# Altium project WiWi_SDR.PrjPcb (part 3 of 5)

## Sheet 11-Power.SchDoc
size B; SheetNumber: 11; SheetTotal: 19; SPICEModelCacheAVYIXNQT: <root> / <DocumentId>AVYIXNQT</DocumentId> / <CacheFrame Number="0"> / <Model Name="emk105bj105_v-f" Kind="CKT"> / <Text>* EMK105BJ105_V-F     SPICE MODEL  ( General Type ) / *-------------------------------------------------------------------------------------------------------- / * Model Generated by TAIYO YUDEN Corporation (http://www.ty-top.com) / * Version 1.0 / * TAIYO YUDEN Control No. 170508_130520 / * Copyright(c) 2012 TAIYO YUDEN CO.,LTD. All Rights Reserved. / *-------------------------------------------------------------------------------------------------------- / * / * Products Name : Multilayer Ceramic Capacitors / * / * Characteristics : / *     Capacitance : 1 uF , Rated Voltage : 16V , TCC : X5R / *     Case Size : 1.0 x 0.5 / 0.039 x 0.02 [mm/inch] , Thickness : 0.5 / 0.02 [mm/inch] / *     (Conditions: Temperature = 25 degC , DC Bias Current/Voltage = 0A / 0V) / * / * Frequency Range : 40Hz - 3GHz / * / * External Node Assignments : / * / *  1  o---| |---o  2 / * / *-------------------------------------------------------------------------------------------------------- / .SubCkt EMK105BJ105_V-F 1 2 / **************************** / C0 1 110 0.68309u / Cm 1 101 0.26053u / C1 101 102 0.94076u / Rc1 101 102 1.9029k / C2 102 103 0.66707u / Rc2 102 103 120.36 / C3 103 110 0.57203u / Rc3 103 110 2.1097 / C2m 1 301 0.1871u / C21 301 302 3.2494u / Rc21 301 302 1.1117k / C22 302 303 2.1014u / Rc22 302 303 1.484k / C23 303 304 2.1172u / Rc23 303 304 1.3876k / C24 304 305 0.75729u / Rc24 304 305 332.59 / C25 305 306 0.94401u / Rc25 305 306 249.09 / C26 306 307 0.34674u / Rc26 306 307 28.352 / C27 307 308 0.37158u / Rc27 307 308 19.989 / C28 308 309 0.17933u / Rc28 308 309 31.748 / C29 309 110 0.016445u / Rc29 309 110 1.0592 / Rp0 1 110 100Meg / L0 110 120 0.2216n / Lm 120 130 0.1509n / L1 120 121 0.12659n / RL1 121 130 0.85161 / L2 120 122 0.15996n / RL2 122 130 0.42469 / L3 120 123 7.9543n / RL3 123 130 0.54643m / CR 120 124 0.24334u / LR 124 125 0.090738n / RR 125 130 68.076m / CL 130 140 2.7354p / LL 130 140 0.10762n / RL 130 140 50.614 / Rs 140 2 7.5416m / **************************** / .ends EMK105BJ105_V-F</Text> / </Model> / </CacheFrame> / </root>
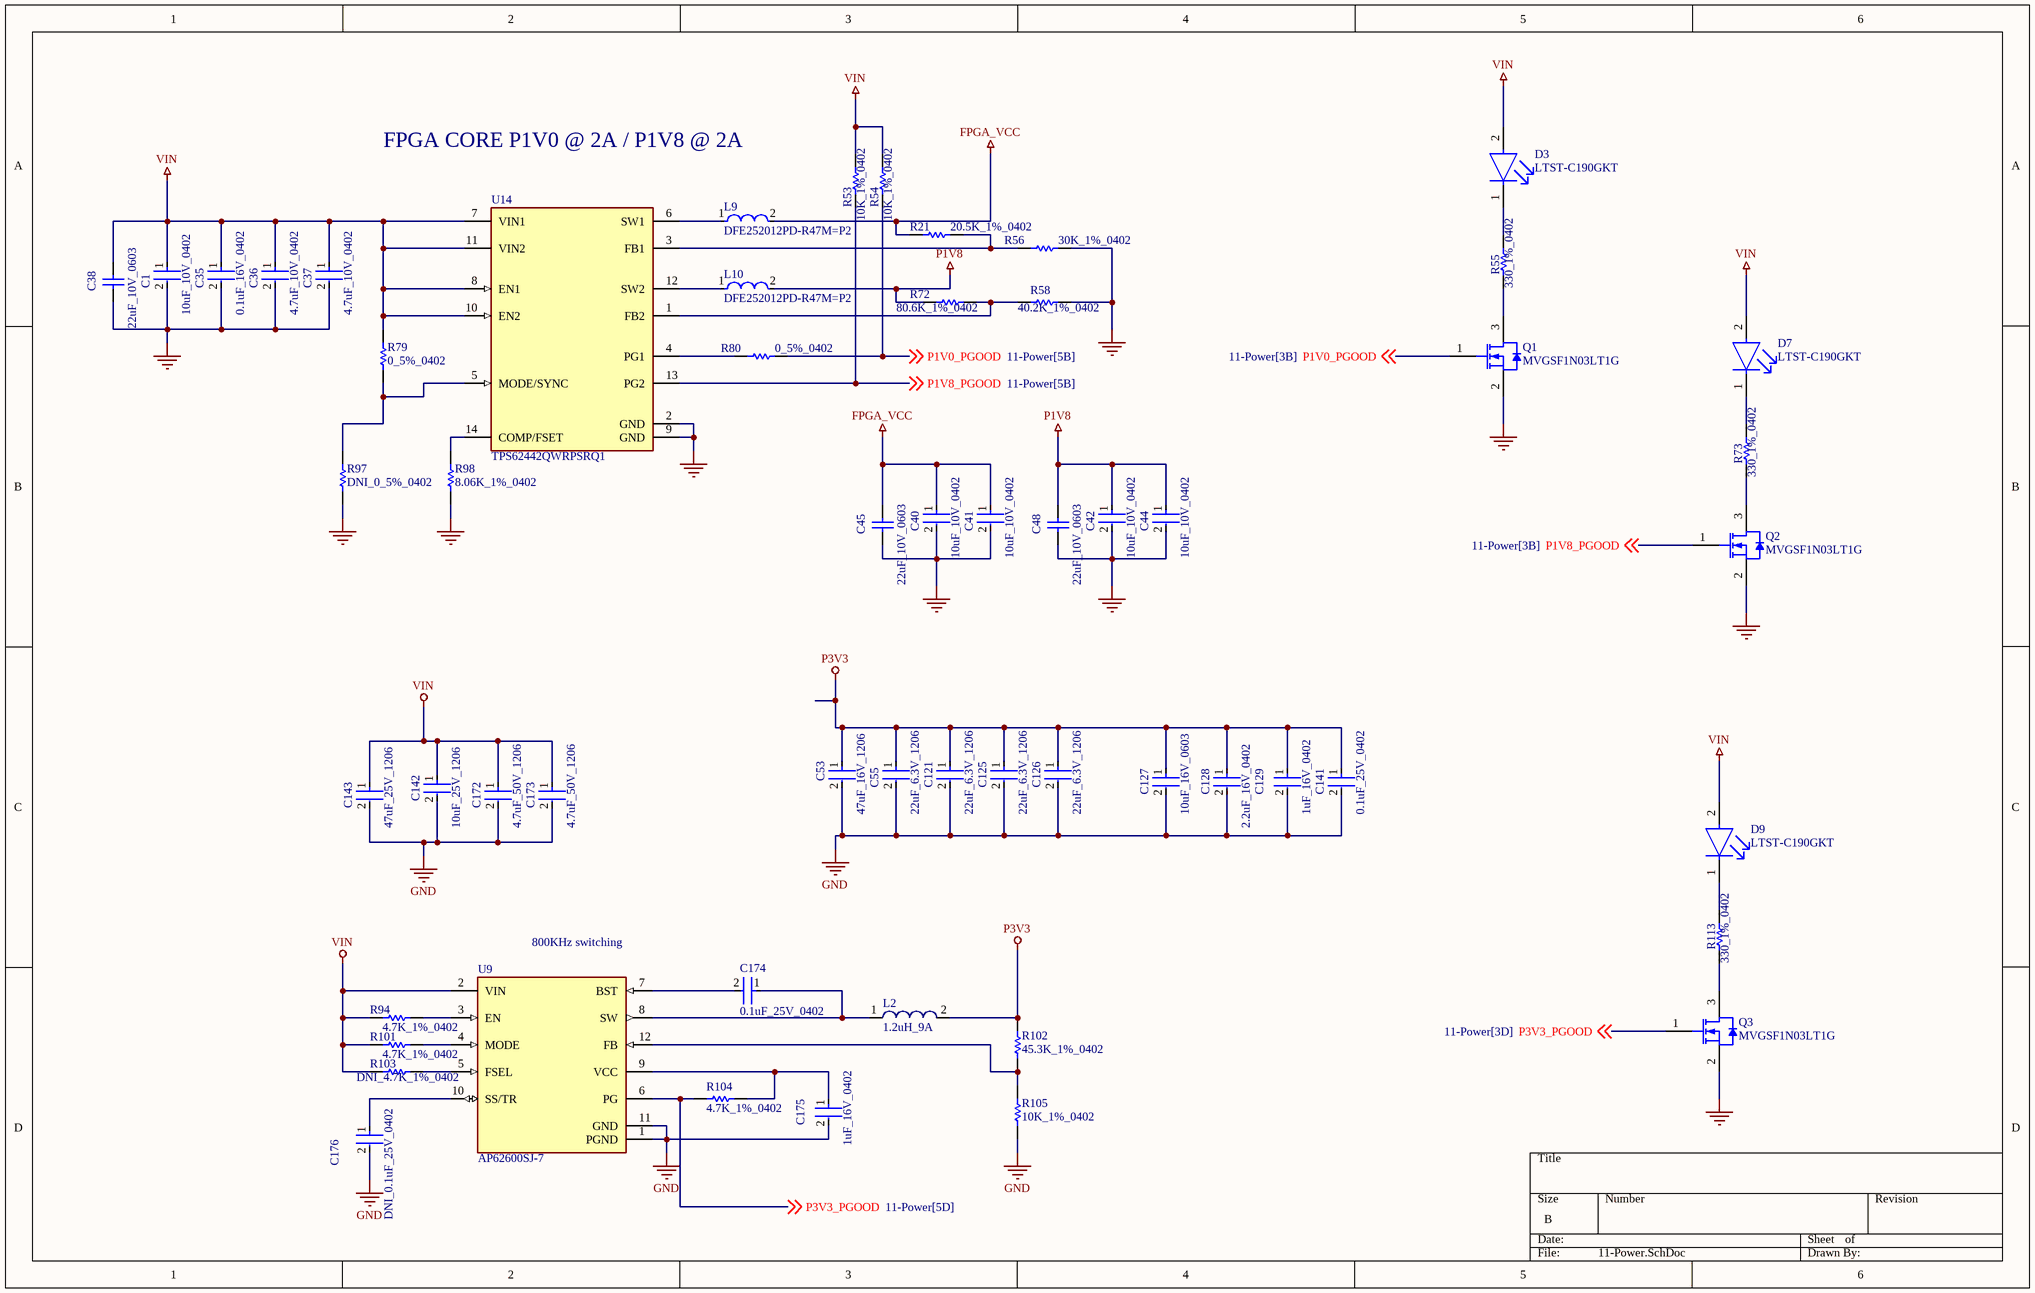
[diagram p8: 11-Power.SchDoc]

### Parts
C1  10uF_10V_0402  [FP-CL05A106MP5NUNC-MFG]
C35  0.1uF_16V_0402  [FP-C0402-BB-MFG]
C36  4.7uF_10V_0402  [FP-C1005-050-0_15-MFG]
C37  4.7uF_10V_0402  [FP-C1005-050-0_15-MFG]
C38  22uF_10V_0603  [CAPC1608X100X20ML10]
C40  10uF_10V_0402  [FP-CL05A106MP5NUNC-MFG]
C41  10uF_10V_0402  [FP-CL05A106MP5NUNC-MFG]
C42  10uF_10V_0402  [FP-CL05A106MP5NUNC-MFG]
C44  10uF_10V_0402  [FP-CL05A106MP5NUNC-MFG]
C45  22uF_10V_0603  [CAPC1608X100X20ML10]
C48  22uF_10V_0603  [CAPC1608X100X20ML10]
C53  47uF_16V_1206  [FP-C3216-160-0_2-MFG]
C55  22uF_6.3V_1206  [FP-1206-L_3_2_0_2-W_1_6_0-IPC_C]
C121  22uF_6.3V_1206  [FP-1206-L_3_2_0_2-W_1_6_0-IPC_C]
C125  22uF_6.3V_1206  [FP-1206-L_3_2_0_2-W_1_6_0-IPC_C]
C126  22uF_6.3V_1206  [FP-1206-L_3_2_0_2-W_1_6_0-IPC_C]
C127  10uF_16V_0603  [FP-0603-L_1_6_0_2-W_0_8_0-MFG]
C128  2.2uF_16V_0402  [FP-C1005-050-0_05-IPC_A]
C129  1uF_16V_0402  [FP-0402-L_1_0_0_05-W_0_5-IPC_A]
C141  0.1uF_25V_0402  [FP-0402-L_1_0_1-W_0_5_0_1-IPC_C]
C142  10uF_25V_1206  [FP-1206-L_3_2_0_2-W_1_6_0-IPC_A]
C143  47uF_25V_1206  [FP-C3216-160-0_2-MFG]
C172  4.7uF_50V_1206  [FP-GRM31C-0_2-e0_3_0_8-IPC_C]
C173  4.7uF_50V_1206  [FP-GRM31C-0_2-e0_3_0_8-IPC_C]
C174  0.1uF_25V_0402  [FP-0402-L_1_0_1-W_0_5_0_1-IPC_C]
C175  1uF_16V_0402  [FP-0402-L_1_0_0_05-W_0_5-IPC_A]
C176  DNI_0.1uF_25V_0402  [FP-0402-L_1_0_1-W_0_5_0_1-IPC_C]  (no BOM)
D3  LTST-C190GKT  [FP-LTST-C190GKT-MFG]
D7  LTST-C190GKT  [FP-LTST-C190GKT-MFG]
D9  LTST-C190GKT  [FP-LTST-C190GKT-MFG]
L2  1.2uH_9A  [WE-LHMI 7050]
L9  DFE252012PD-R47M=P2  [FP-DFE252012C-IPC_A]
L10  DFE252012PD-R47M=P2  [FP-DFE252012C-IPC_A]
Q1  MVGSF1N03LT1G  [ONSC-SOT-23-3-318-08_V]
Q2  MVGSF1N03LT1G  [ONSC-SOT-23-3-318-08_V]
Q3  MVGSF1N03LT1G  [ONSC-SOT-23-3-318-08_V]
R21  20.5K_1%_0402  [RESC1005X40X25NL10T10]
R53  10K_1%_0402  [RESC1005X40X25NL10T10]
R54  10K_1%_0402  [RESC1005X40X25NL10T10]
R55  330_1%_0402  [RESC1005X40X25NL10T10]
R56  30K_1%_0402  [RESC1005X40X25ML05T05]
R58  40.2K_1%_0402  [RESC1005X40X25ML05T10]
R72  80.6K_1%_0402  [RESC1005X40X25NL05T10]
R73  330_1%_0402  [RESC1005X40X25NL10T10]
R79  0_5%_0402  [RESC1005X40X25NL05T10]
R80  0_5%_0402  [RESC1005X40X25NL05T10]
R94  4.7K_1%_0402  [RESC1005X40X25NL10T10]
R97  DNI_0_5%_0402  [RESC1005X40X25NL05T10]  (no BOM)
R98  8.06K_1%_0402  [RESC1005X40X25ML05T05]
R101  4.7K_1%_0402  [RESC1005X40X25NL10T10]
R102  45.3K_1%_0402  [RESC1005X40X25ML05T10]
R103  DNI_4.7K_1%_0402  [RESC1005X40X25NL10T10]  (no BOM)
R104  4.7K_1%_0402  [RESC1005X40X25NL10T10]
R105  10K_1%_0402  [RESC1005X40X25NL10T10]
R113  330_1%_0402  [RESC1005X40X25NL10T10]
U9  AP62600SJ-7  [FP-V-QFN2030-12_Type_A-MFG]
U14  TPS62442QWRPSRQ1  [FP-RQR0014A-MFG]

### Nets
FPGA_VCC: C40.1 C41.1 C45.2 L9.2 R21.1
GND: C1.2 C35.2 C36.2 C37.2 C38.1 C40.2 C41.2 C42.2 C44.2 C45.1 C48.1 C53.2 C55.2 C121.2 C125.2 C126.2 C127.2 C128.2 C129.2 C141.2 C142.2 C143.2 C172.2 C173.2 C175.2 C176.2 Q1.2(S) Q2.2(S) Q3.2(S) R56.2 R58.2 R97.1 R98.1 R105.1 U9.1(PGND) U9.11(GND) U14.2(GND) U14.9(GND)
P1V8: C42.1 C44.1 C48.2 L10.2 R72.1
P3V3: C53.1 C55.1 C121.1 C125.1 C126.1 C127.1 C128.1 C129.1 C141.1 L2.2 R102.2
VIN: C1.1 C35.1 C36.1 C37.1 C38.2 C142.1 C143.1 C172.1 C173.1 D3.2(A) D7.2(A) D9.2(A) R53.2 R54.2 R79.2 R94.1 R101.1 R103.1 U9.2(VIN) U14.7(VIN1) U14.8(EN1) U14.10(EN2) U14.11(VIN2)
P1V0_PGOOD: Q1.1(G) R54.1 R80.2 ; off-sheet P1V0_PGOOD
P1V8_PGOOD: Q2.1(G) R53.1 U14.13(PG2) ; off-sheet P1V8_PGOOD
P3V3_PGOOD: Q3.1(G) R104.2 U9.6(PG) ; off-sheet P3V3_PGOOD
NetC174_1: C174.1 L2.1 U9.8(SW)
NetC174_2: C174.2 U9.7(BST)
NetC175_1: C175.1 R104.1 U9.9(VCC)
NetC176_1: C176.1 U9.10(SS/TR)
NetD3_1: D3.1(C) R55.2
NetD7_1: D7.1(C) R73.2
NetD9_1: D9.1(C) R113.2
NetL9_1: L9.1 U14.6(SW1)
NetL10_1: L10.1 U14.12(SW2)
NetQ1_3: Q1.3(D) R55.1
NetQ2_3: Q2.3(D) R73.1
NetQ3_3: Q3.3(D) R113.1
NetR21_2: R21.2 R56.1 U14.3(FB1)
NetR58_1: R58.1 R72.2 U14.1(FB2)
NetR79_1: R79.1 R97.2 U14.5(MODE/SYNC)
NetR80_1: R80.1 U14.4(PG1)
NetR94_2: R94.2 U9.3(EN)
NetR98_2: R98.2 U14.14(COMP/FSET)
NetR101_2: R101.2 U9.4(MODE)
NetR102_1: R102.1 R105.2 U9.12(FB)
NetR103_2: R103.2 U9.5(FSEL)

### Notes on the sheet
- FPGA CORE P1V0 @ 2A / P1V8 @ 2A
- (near U9) 800KHz switching

### Library data of the parts
C1 C40-C42 C44 = CMP-13271-000002-1: CAP CER 10UF 10V X5R 0402; Manufacturer Part Number: CL05A106MP5NUNC; Manufacturer: Samsung; Temperature Coefficient: 15%; Tolerance: 20%; Material: Ceramic; Octopart: https://octopart.com/cl05a106mp5nunc-samsung-22457395; Voltage Rating: 10V; RoHS: TRUE; Value: 10uF; Height: 0.7mm; Digikey Description: CAP CER 10UF 10V X5R 0402; Automotive: No; Package: CL05A106MP5NUNC; Device Class L1: Passive Components; Capacitance: 10uF; Temperature Range High: +85°C; ComponentLink2Description: Datasheet; Device Class L2: Capacitors; Temperature Characteristic: X5R; Temperature: -55°C to +85°C; ComponentLink2URL: http://www.samsungsem.com/kr/support/product-search/mlcc/__icsFiles/afieldfile/2019/05/10/19-CL05A106MP5NUNC.pdf; Device Class L3: Ceramic Capacitors; Category: Cap; Temperature Range Low: -55°C; Ipc Land Pattern Name: CAPC10050X50; Lead Free: Yes
C35 = CMP-1034-02068-3: CAP CER 0.1UF 16V 5% X7R 0402; Manufacturer: Kemet; Manufacturer Part Number: C0402C104J4RACTU; Value: 0.10 μF; Temperature Coefficient: 15%; Tolerance: 0.05; Material: Ceramic; ComponentLink2URL: https://content.kemet.com/datasheets/KEM_C1002_X7R_SMD.pdf; Automotive: No; Device Class L2: Capacitors; Temperature: -55°C to +125°C; RoHS: TRUE; Voltage Rating: 16 V; ComponentLink2Description: Datasheet; Device Class L3: Ceramic Capacitors; Temperature Range Low: -55°C; Ipc Land Pattern Name: CAPC10050X50; Device Class L1: Passive Components; Temperature Range High: +125°C; Package: C0402-BB; Capacitance: 0.10 μF; Category: Cap; Mouser Description: CAP CER 0.1UF 16V X7R 0402; Height: 0.55mm; Digikey Description: CAP CER 0.1UF 16V 5% X7R 0402; Octopart: https://octopart.com/c0402c104j4ractu-kemet-12573893; Temperature Characteristic: X7R; Lead Free: Yes
C36 C37 = CMP-2000-05997-2: CAP CER 4.7UF 10V X5R 0402; Dielectric Material: Ceramic; Tolerance: 10%; Series: C; Package Quantity: 10000; Max Operating Temperature: 85°C; Case Code (Imperial): 0402; Lead Free: Lead Free; Voltage Rating (DC): 10V; Packaging: Cut Tape; Voltage Rating: 10V; Min Operating Temperature: -55°C; Dielectric: X5R; Thickness: 0.022inch; Width: 0.02inch; Case/Package: 0402; Case Code (Metric): 1005; Capacitance: 4.7uF; Length: 0.039inch; RoHS Compliant: Yes; REACH SVHC: No SVHC; Mount: Surface Mount
C38 C45 C48 = CMP-2000-05441-1: Chip Capacitor, 22 uF, +/- 20%, 10 V, -55 to 85 degC, 0603 (1608 Metric), RoHS, Tape and Reel; Manufacturer: TDK; PCN Part Number: MLCCPartNumberChange30/Nov/2012; Voltage - Rated: 10V; Product Training Modules: CSeriesGeneralApplicationsSEAT,CCV,andTVCLDesignToolsGuidetoReplacinganElectrolyticCapacitorwithanMLCC; Other Names: 445-9077-1; Design Resources: 20WNon-IsolatedBuckLEDDriverUsingPLLNK460KG; Online Catalog: CSeries,GeneralPurpose; Capacitance: 22µF; Temperature Coefficient: X5R; Kits: 445-9014-KIT-ND-KITMLCC100PF-22UF060310-50V; Packaging: CutTape(CT); Standard Package: 1; Package / Case: 0603(1608Metric); Lead Style: -; Features: -; Ratings: -; Operating Temperature: -55degC~85degC; Applications: GeneralPurpose; Package Reference: 603; Datasheet URL: http://download.siliconexpert.com/pdfs/2015/4/21/15/54/45/779/tdk_/manual/37024850441143360mlcc_commercial_general_en.pdf; Datasheet Version: Mar-15; Mounting Type: SurfaceMount,MLCC; Lead Spacing: -; Size / Dimension: 0.063"Lx0.031"W(1.60mmx0.80mm); Height - Seated (Max): -; Package Description: 2-Pin Surface Mount Device, Body 1.6 x 0.8 mm; Manufacturer URL: http://www.tdk.com/; RoHS Information: RoHSCertificate-MLCC; Tolerance: ±20%; Series: C; Thickness (Max): 0.035"(0.90mm); Family: CeramicCapacitors; Category: Capacitors
C53 = CMP-2000-07442-2: Multilayer Ceramic Capacitors 47uF ±20% 16V X5R SMD 1206; Resistor Type: Ceramic; Width: 0.063inch; Case Code (Imperial): 1206; Radiation Hardening: No; Thickness: 0.071inch; Dielectric: X5R; Weight: 0.000571oz; Termination: SMD/SMT; Dielectric Material: Ceramic; Min Operating Temperature: -55°C; Depth: 1.6mm; Case Code (Metric): 3216; Max Operating Temperature: 85°C; RoHS Compliant: Yes; REACH SVHC: No SVHC; Mount: Surface Mount; Lead Free: Lead Free; Height: 1.6mm; Length: 3.2mm; Tolerance: 20%; Voltage Rating (DC): 16V; Capacitance: 47uF; Package Quantity: 1; Construction: Flat; Packaging: Tape and Reel; Series: C; Case/Package: 1206; Voltage Rating: 16V
C55 C121 C125 C126 = CMP-2000-05869-2: General Purpose Ceramic Capacitor, 1206, 22uF, 20%, X5R, 15%, 6.3V; Lead Free: Lead Free; Case Code (Metric): 3216; Case/Package: 1206; Depth: 1.6mm; Capacitance: 22uF; Length: 3.2mm; Series: -; Contact Plating: Tin; Tolerance: 20%; REACH SVHC: No SVHC; Radiation Hardening: No; RoHS Compliant: Yes; Termination: SMD/SMT; Voltage Rating: 6.3V; Packaging: Tape and Reel; Voltage: 6.3V; Mount: Surface Mount; Thickness: 0.07inch; Package Quantity: 1; Voltage Rating (DC): 6.3V; Case Code (Imperial): 1206; Construction: Flat; Dielectric: X5R; Number of Pins: 2; Min Operating Temperature: -55°C; Height: 0.07mm; Width: 0.063inch; Max Operating Temperature: 85°C
C127 = CMP-2000-06226-4: Multilayer Ceramic Capacitor 10uF 16V X5R 20% SMD 0603 T/R; Packaging: Tape and Reel; Construction: Flat; Height: 0.8mm; Max Operating Temperature: 85°C; Dielectric: X5R; Case Code (Metric): 1608; Voltage Rating (DC): 16V; Width: 0.031inch; Voltage Rating: 16V; Length: 0.063inch; RoHS Compliant: Yes; Halogen Free: Halogen Free; Case Code (Imperial): 0603; Capacitance: 10uF; Mount: Surface Mount; Thickness: 0.031inch; Tolerance: 20%; Min Operating Temperature: -55°C; Series: M; Termination: SMD/SMT; Case/Package: 0603; Package Quantity: 1
C128 = CMP-2000-05998-2: Multilayer Ceramic Capacitors 2.2μF ±10% 16V X5R SMD 0402; Capacitance: 2.2uF; REACH SVHC: No SVHC; Series: C; Termination: SMD/SMT; Case Code (Imperial): 0402; Depth: 0.5mm; Mount: Surface Mount; Width: 0.02inch; Package Quantity: 1; Dielectric Material: Ceramic; Length: 1mm; Packaging: Tape and Reel; Case Code (Metric): 1005; RoHS Compliant: Yes; Dielectric: X5R; Max Operating Temperature: 85°C; Lead Free: Lead Free; Weight: 2.3E-05oz; Thickness: 0.022inch; Voltage Rating (DC): 16V; Tolerance: 10%; Voltage Rating: 16V; Resistor Type: Ceramic; Height: 0.5mm; Case/Package: 0402; Min Operating Temperature: -55°C
C129 C175 = CMP-14477-000104-2: None; Tolerance: 10%; Voltage Rating: 16V; Dielectric: X5R; Capacitance: 1uF; Packaging: Tape and Reel; Depth: 0.5mm; Mount: Surface Mount; Thickness: 0.022inch; Package Quantity: 1; Min Operating Temperature: -55°C; Series: M; Voltage Rating (DC): 16V; Termination: SMD/SMT; Case/Package: 0402; Number of Pins: 2; Case Code (Imperial): 0402; Length: 1mm; Halogen Free: Halogen Free; Case Code (Metric): 1005; Width: 0.02inch; RoHS Compliant: Yes; Radiation Hardening: No; Max Operating Temperature: 85°C; Height: 0.5mm; Construction: Flat
C141 C174 C176 = CMP-2008-02519-2: General Purpose Ceramic Capacitor, 0402, 100nF, 10%, X7R, 15%, 25V; Package Quantity: 1; Capacitance: 100nF; Min Operating Temperature: -55°C; Voltage: 25V; Voltage Rating: 25V; Construction: Flat; Max Operating Temperature: 125°C; Radiation Hardening: No; Depth: 0.5mm; Thickness: 0.022inch; Voltage Rating (DC): 25V; Number of Pins: 2; Lead Free: Lead Free; Series: -; REACH SVHC: No SVHC; Length: 1mm; Dielectric: X7R; RoHS Compliant: Yes; Mount: Surface Mount; Packaging: Tape and Reel; Case/Package: 0402; Case Code (Imperial): 0402; Termination: SMD/SMT; Width: 0.02inch; Case Code (Metric): 1005; Tolerance: 10%
C142 = CMP-04427-006943-1: General Purpose Ceramic Capacitor, 1206, 10uF, 20%, X5R, 15%, 25V; Dissipation Factor: 12.5%; Insulation Resistance: 10GR; Case Code (Imperial): 1206; Series: -; Construction: Flat; Termination: SMD/SMT; Case/Package: 1206; Dielectric: X5R; Width: 1.6mm; Max Operating Temperature: 85°C; Height: 0.07mm; Package Quantity: 1; Depth: 1.6mm; Voltage Rating: 25V; Capacitance: 10uF; RoHS Compliant: Yes; Mount: Surface Mount; Radiation Hardening: No; Voltage Rating (DC): 25V; Number of Pins: 2; Contact Plating: Tin; Min Operating Temperature: -55°C; Lead Free: Lead Free; Packaging: Tape and Reel; Tolerance: 20%; Case Code (Metric): 3216; Thickness: 0.07inch; Length: 3.2mm; REACH SVHC: No SVHC
C143 = CMP-2000-05397-3: Multilayer Ceramic Capacitors 47uF ±20% 25V X5R SMD 1206; Weight: 0.000571oz; Dielectric: X5R; Length: 0.126inch; Voltage Rating: 25V; Case/Package: 1206; Dielectric Material: Ceramic; Min Operating Temperature: -55°C; Lead Free: Lead Free; Packaging: Tape and Reel; Package Quantity: 1; Mount: Surface Mount; Depth: 1.6mm; REACH SVHC: No SVHC; Termination: SMD/SMT; Case Code (Imperial): 1206; Series: C; Resistor Type: Ceramic; Voltage: 25V; Width: 0.063inch; Height: 1.6mm; Tolerance: 20%; Capacitance: 47uF; Max Operating Temperature: 85°C; Voltage Rating (DC): 25V; RoHS Compliant: Yes; Thickness: 0.071inch; Case Code (Metric): 3216
C172 C173 = CMP-1037-04923-3: Chip Multilayer Ceramic Capacitors for General Purpose, 1206, 4.7uF, X7R, 15%, 10%, 50V; Height: 1.6mm; Voltage: 50V; Capacitance: 4.7uF; Lead Free: Lead Free; Max Operating Temperature: 125°C; Packaging: Tape and Reel; REACH SVHC: No SVHC; Voltage Rating: 50V; Mount: Surface Mount; Termination: SMD/SMT; Tolerance: 10%; Case/Package: 1206; Material: Ceramic; Depth: 1.6mm; Length: 3.2mm; Case Code (Metric): 3216; Voltage Rating (DC): 50V; Case Code (Imperial): 1206; Radiation Hardening: No; Width: 0.063inch; Thickness: 0.071inch; Package Quantity: 2000; Min Operating Temperature: -55°C; Dielectric: X7R
D3 D7 D9 = CMP-22017-000005-2: LED GREEN CLEAR CHIP SMD; Dominant Wavelength: 569nm; Reverse Voltage: 5V; Lens Color: Colorless; Viewing Angle: 130°; Voltage: 2V; Forward Current: 30mA; Power Dissipation: 100mW; Luminous Intensity: 6mcd; Number of LEDs: 1; Forward Voltage: 2.1V; Wavelength: 565nm; Test Current: 10mA; Min Operating Temperature: -55°C; Lens Style: Clear; Mount: Surface Mount; Width: 0.8mm; Packaging: Tape and Reel; Lens Transparency: Clear; Case Code (Metric): 1608; Depth: 0.8mm; Case Code (Imperial): 0603; Case/Package: 0603; Number of Pins: 2; Max Operating Temperature: 85°C; Lead Free: Lead Free; Number of Elements: 1; Length: 1.6mm; Height: 0.8mm; Package Quantity: 1; Power Rating: 100mW; Radiation Hardening: No; Illumination Color: Green; Color: Green
L2 = CMP-1353-00066-2: SMD Power Inductor WE-LHMI, L=1.2 µH; Manufacturer: Wuerth Elektronik; PartNumber: 74437349012; Inductance: 1.2 ÂµH; ComponentLink1Description: Manufacturer URL; ComponentLink2URL: http://katalog.we-online.de/kataloge/eisos/media/pdf/74437349012.pdf; ComponentLink1URL: http://www.we-online.com; PackageReference: WE-LHMI 7050; ComponentLink2Description: Datasheet
L9 L10 = CMP-06042-015149-1: Shielded Wirewound Inductor 0.47uH 20% 4000mA 0.027Ω 1008 (2520)
Q1-Q3 = CMP-1058-00779-1: Power MOSFET, 30 V, 2.1 A, Single N-Channel, 3-Pin SOT-23, Pb-Free, Tape and Reel; Manufacturer: On Semiconductor; V(BR)DSS Min (V): 30; VGS(th) Max (V): 2.4; Ciss Typ (pF): 140; VGS Max (V): 20; Channel Polarity: N Channel; ID Max (A): 2.1; Coss Typ (pF): 100; Crss Typ (pF): 40; ComponentLink3URL: http://www.onsemi.cn/pub_link/Collateral/318-08.PDF; Configuration: Single; PackageDescription: 3-Pin Small Outline Transistor, Body 2.92 x 1.3 mm, Pitch 0.95 mm; Packing: Tape and Reel; PartNumber: MVGSF1N03LT1G; ComponentLink2URL: http://www.onsemi.cn/pub_link/Collateral/MGSF1N03LT1-D.PDF; PackageVersion: Rev. AP, 11/2009; ComponentLink3Description: Package Specification; Package Type: SOT-23-3; ComponentLink1Description: Manufacturer URL; DatasheetVersion: Rev. 10; PackageReference: SOT-23-3-318-08; ComponentLink2Description: Datasheet; ComponentLink1URL: http://www.onsemi.com/; RoHS: Pb-Free; Mounting Technology: Surface Mount
R21 = CMP-2002-06040-1: Manufacturer: Multicomp; Part Number: MC00625W0402120K5
R53 R54 R105 = CMP-2002-04694-1: Manufacturer: Bourns; Part Number: CR0402-FX-1002GLF
R55 R73 R113 = CMP-2002-05853-1: Manufacturer: Panasonic; Part Number: ERA-2AED331X
R56 = CMP-2002-00511-1: Part Number: ERJ-2GEJ303X; Manufacturer: Panasonic
R58 = CMP-2002-07676-1: Part Number: RC0402FR-0740K2L; Manufacturer: Yageo / Phycomp
R72 = CMP-2002-07812-1: Part Number: RC0402FR-0780K6L; Manufacturer: Yageo / Phycomp
R79 R80 R97 = CMP-2002-06457-1: Manufacturer: Panasonic; Part Number: ERJ-U020R00X
R94 R101 R103 R104 = CMP-2002-05217-1: Manufacturer: Bourns; Part Number: CR0402-FX-4701GLF
R98 = CMP-2002-00253-3: Chip Resistor, 8.06 KOhm, +/- 1%, 63 mW, -55 to 155 degC, 0402 (1005 Metric), RoHS, Tape and Reel; PartNumber: CRCW04028K06FKED; Manufacturer: Basic Passives; Case\/Package: 0402; Power Rating: 63 mW; Voltage Rating: 50 V; PackageReference: 0402; Radiation Hardening: No; Package Quantity: 10000; Height: 0.35 mm; Packaging: Tape and Reel; Mount: Surface Mount; Length: 1 mm; Weight: 2.3E-05oz; Case Code (Metric): 1005; DatasheetVersion: 06/2012; Pins: 2; Min Operating Temperature: -55 degC; Case Code (Imperial): 0402; REACH SVHC: Unknown; Tolerance: 1%; Mounting Technology: Surface Mount; ComponentLink1URL: http://www.vishay.com/; ComponentLink2URL: http://www.vishay.com/docs/20035/dcrcwe3.pdf; ComponentLink2Description: Datasheet; Resistance: 8.06 KOhm; Max Operating Temperature: 155 degC; ComponentLink1Description: Manufacturer URL; Width: 0.5 mm; RoHSCompliant: true; PackageDescription: 2-Pin Surface Mount Device, Body 1 x 0.5 mm
R102 = CMP-2002-07692-1: Part Number: RC0402FR-0745K3L; Manufacturer: Yageo / Phycomp
U9 = CMP-12757-000022-1: DCDC CONV HV BUCK,V-QFN2030-12; RoHS Compliant: Yes
U14 = CMP-04918-000654-1: Adjustable-Frequency Dual Step-Down Converter, 2.7-6V VIN, 0.6-5.5V 2A VOUT, VQFN-HR14

## Sheet 12-FPGA_Power.SchDoc
size B; SheetNumber: 11; SheetTotal: 16
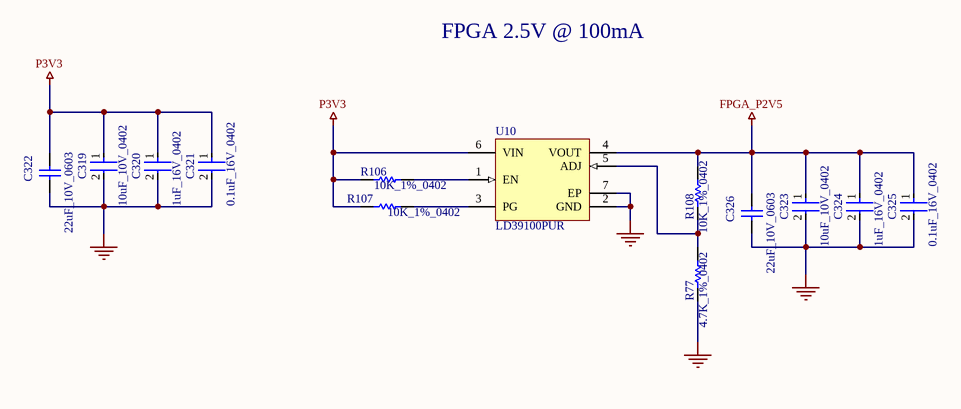
[diagram p9: 12-FPGA_Power.SchDoc]

### Parts
C319  10uF_10V_0402  [FP-CL05A106MP5NUNC-MFG]
C320  1uF_16V_0402  [FP-0402-L_1_0_0_05-W_0_5-IPC_A]
C321  0.1uF_16V_0402  [FP-C0402-BB-MFG]
C322  22uF_10V_0603  [CAPC1608X100X20ML10]
C323  10uF_10V_0402  [FP-CL05A106MP5NUNC-MFG]
C324  1uF_16V_0402  [FP-0402-L_1_0_0_05-W_0_5-IPC_A]
C325  0.1uF_16V_0402  [FP-C0402-BB-MFG]
C326  22uF_10V_0603  [CAPC1608X100X20ML10]
R77  4.7K_1%_0402  [RESC1005X40X25NL10T10]
R106  10K_1%_0402  [RESC1005X40X25NL10T10]
R107  10K_1%_0402  [RESC1005X40X25NL10T10]
R108  10K_1%_0402  [RESC1005X40X25NL10T10]
U10  LD39100PUR  [DFN6D_M]

### Nets
FPGA_P2V5: C323.1 C324.1 C325.1 C326.2 R108.2 U10.4(VOUT)
GND: C319.2 C320.2 C321.2 C322.1 C323.2 C324.2 C325.2 C326.1 R77.1 U10.2(GND) U10.7(EP)
P3V3: C319.1 C320.1 C321.1 C322.2 R106.2 R107.2 U10.6(VIN)
NetR77_2: R77.2 R108.1 U10.5(ADJ)
NetR106_1: R106.1 U10.1(EN)
NetR107_1: R107.1 U10.3(PG)

### Notes on the sheet
- FPGA 2.5V @ 100mA

### Library data of the parts
C319 C323 = CMP-13271-000002-1: as C1 on sheet 11-Power; Octopart: https://octopart.com/cl05a106mp5nunc-samsung-22457395; Voltage Rating: 10V; RoHS: TRUE; Value: 10uF; Height: 0.7mm; Digikey Description: CAP CER 10UF 10V X5R 0402; Automotive: No; Package: CL05A106MP5NUNC; Device Class L1: Passive Components; Capacitance: 10uF; Temperature Range High: +85°C; ComponentLink2Description: Datasheet; Device Class L2: Capacitors; Temperature Characteristic: X5R; Temperature: -55°C to +85°C; ComponentLink2URL: http://www.samsungsem.com/kr/support/product-search/mlcc/__icsFiles/afieldfile/2019/05/10/19-CL05A106MP5NUNC.pdf; Device Class L3: Ceramic Capacitors; Category: Cap; Temperature Range Low: -55°C; Ipc Land Pattern Name: CAPC10050X50; Lead Free: Yes
C320 C324 = CMP-14477-000104-2: as C129 on sheet 11-Power; Packaging: Tape and Reel; Depth: 0.5mm; Mount: Surface Mount; Thickness: 0.022inch; Package Quantity: 1; Min Operating Temperature: -55°C; Series: M; Voltage Rating (DC): 16V; Termination: SMD/SMT; Case/Package: 0402; Number of Pins: 2; Case Code (Imperial): 0402; Length: 1mm; Halogen Free: Halogen Free; Case Code (Metric): 1005; Width: 0.02inch; RoHS Compliant: Yes; Radiation Hardening: No; Max Operating Temperature: 85°C; Height: 0.5mm; Construction: Flat
C321 C325 = CMP-1034-02068-3: as C35 on sheet 11-Power; ComponentLink2URL: https://content.kemet.com/datasheets/KEM_C1002_X7R_SMD.pdf; Automotive: No; Device Class L2: Capacitors; Temperature: -55°C to +125°C; RoHS: TRUE; Voltage Rating: 16 V; ComponentLink2Description: Datasheet; Device Class L3: Ceramic Capacitors; Temperature Range Low: -55°C; Ipc Land Pattern Name: CAPC10050X50; Device Class L1: Passive Components; Temperature Range High: +125°C; Package: C0402-BB; Capacitance: 0.10 μF; Category: Cap; Mouser Description: CAP CER 0.1UF 16V X7R 0402; Height: 0.55mm; Digikey Description: CAP CER 0.1UF 16V 5% X7R 0402; Octopart: https://octopart.com/c0402c104j4ractu-kemet-12573893; Temperature Characteristic: X7R; Lead Free: Yes
C322 C326 = CMP-2000-05441-1: as C38 on sheet 11-Power; Packaging: CutTape(CT); Standard Package: 1; Package / Case: 0603(1608Metric); Lead Style: -; Features: -; Ratings: -; Operating Temperature: -55degC~85degC; Applications: GeneralPurpose; Package Reference: 603; Datasheet URL: http://download.siliconexpert.com/pdfs/2015/4/21/15/54/45/779/tdk_/manual/37024850441143360mlcc_commercial_general_en.pdf; Datasheet Version: Mar-15; Mounting Type: SurfaceMount,MLCC; Lead Spacing: -; Size / Dimension: 0.063"Lx0.031"W(1.60mmx0.80mm); Height - Seated (Max): -; Package Description: 2-Pin Surface Mount Device, Body 1.6 x 0.8 mm; Manufacturer URL: http://www.tdk.com/; RoHS Information: RoHSCertificate-MLCC; Tolerance: ±20%; Series: C; Thickness (Max): 0.035"(0.90mm); Family: CeramicCapacitors; Category: Capacitors
R77 = CMP-2002-05217-1: as R94 on sheet 11-Power
R106-R108 = CMP-2002-04694-1: as R53 on sheet 11-Power
U10 = CMP-0244-00287-1: 1 A Low Quiescent Current Low Noise Voltage Regulator, Adjustable from 0.8V, 6-Pin VFDFPN, Tape and Reel; ComponentLink1URL: http://www.st.com; ComponentLink1Description: Manufacturer URL; ComponentLink2Description: Datasheet; DatasheetVersion: 1/10/2011; PackageDescription: 6-Pin Plastic, Dual LLP, 3 x 3 mm Body, 0.95 mm Pitch, Exposed Pad; PackageReference: DFN6D; ComponentLink2URL: http://www.st.com/internet/com/TECHNICAL_RESOURCES/TECHNICAL_LITERATURE/DATASHEET/CD00233788.pdf; PackageVersion: 2008

## Sheet 13-ESP32S3.SchDoc
size B; SheetNumber: 13; SheetTotal: 19
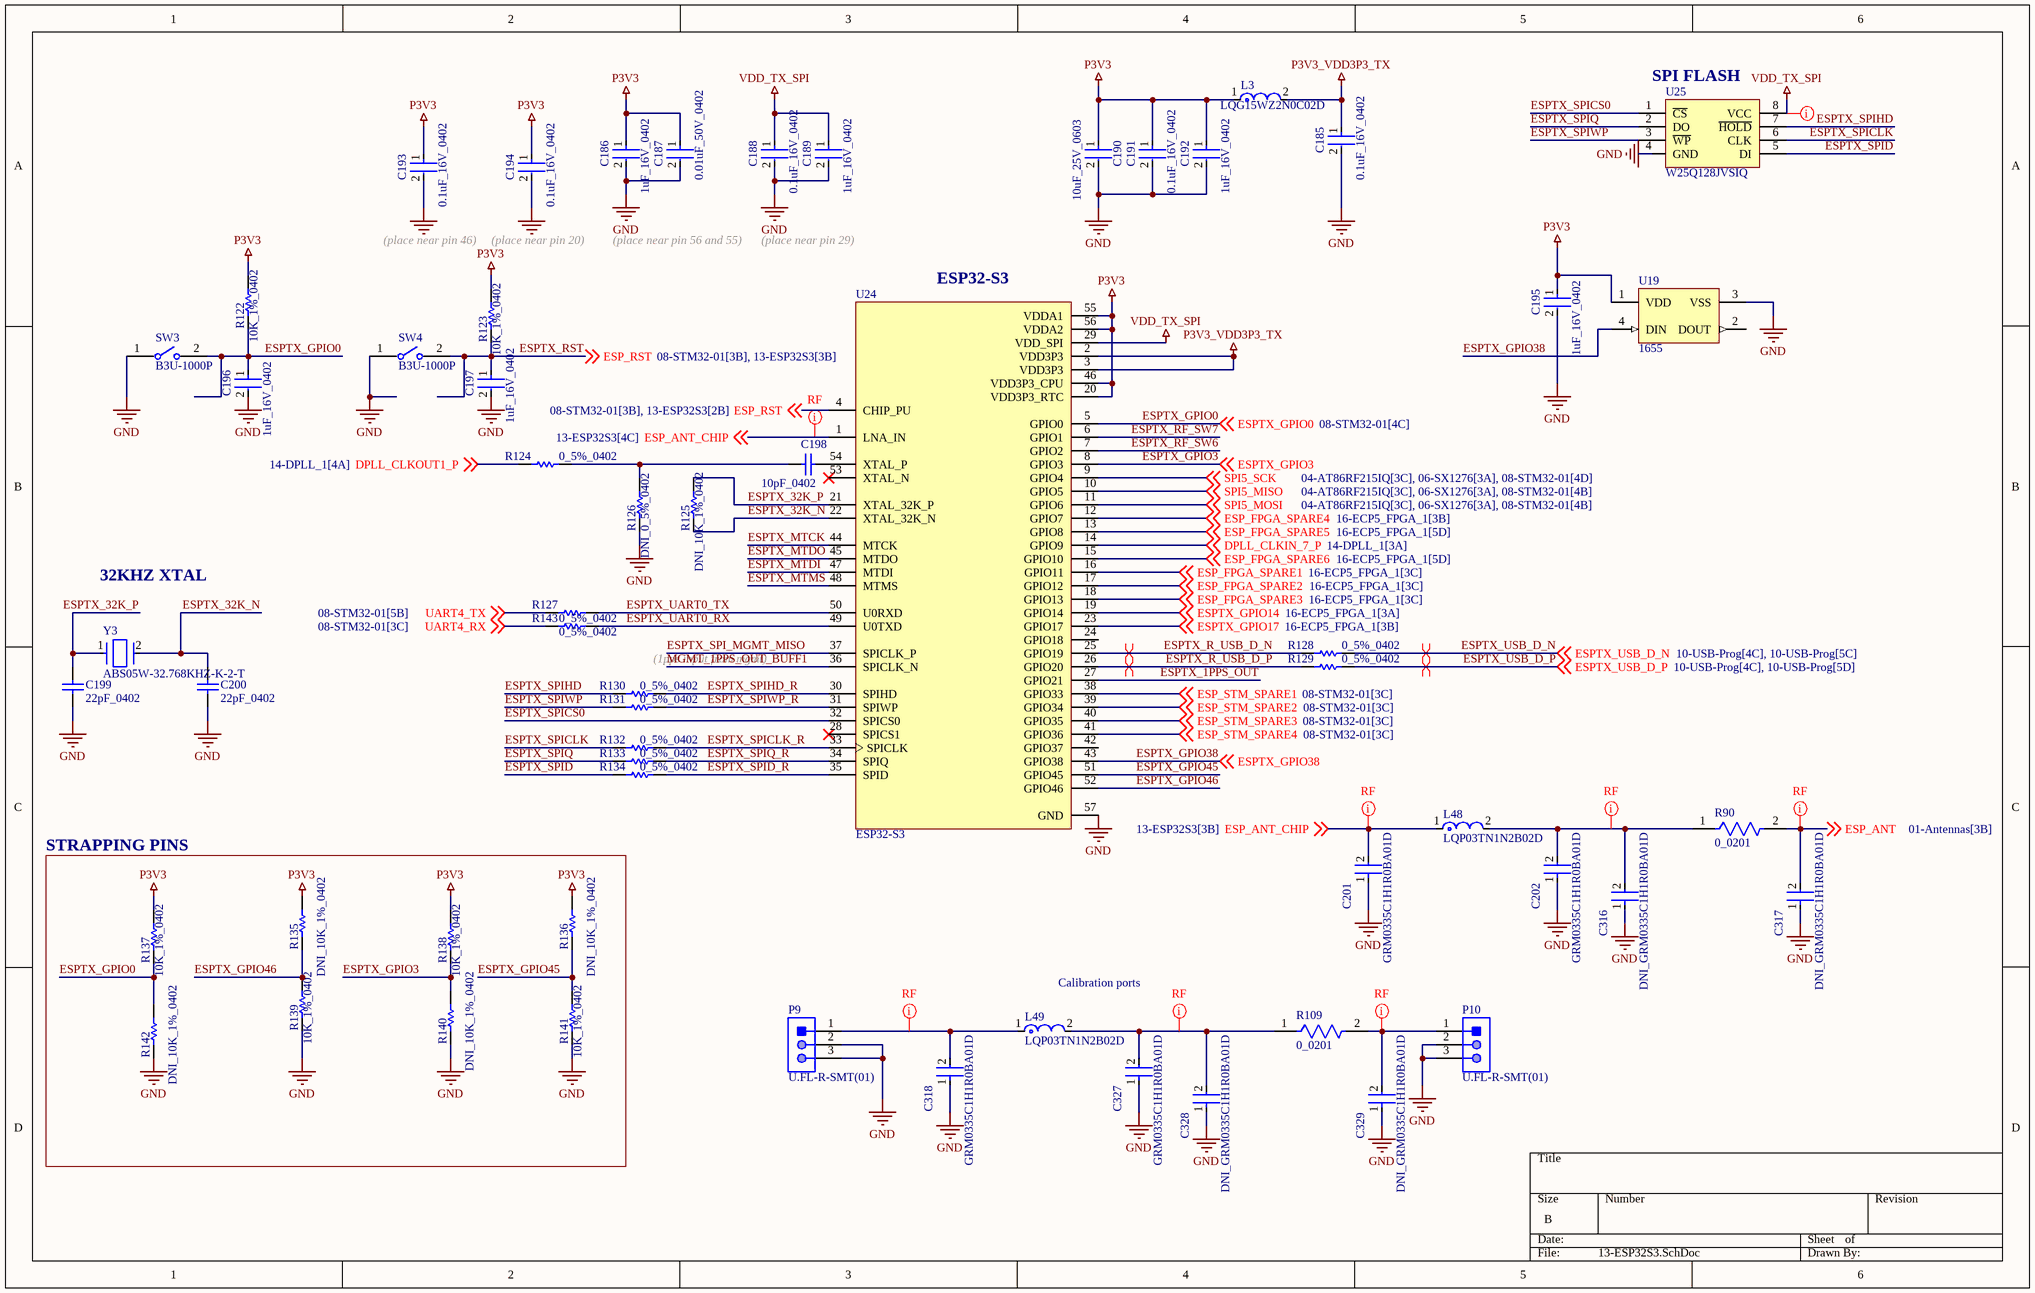
[diagram p10: 13-ESP32S3.SchDoc]

### Parts
C185  0.1uF_16V_0402  [FP-C0402-BB-MFG]
C186  1uF_16V_0402  [FP-0402-L_1_0_0_05-W_0_5-IPC_A]
C187  0.01uF_50V_0402  [FP-GCM155-0_05-IPC_C]
C188  0.1uF_16V_0402  [FP-C0402-BB-MFG]
C189  1uF_16V_0402  [FP-0402-L_1_0_0_05-W_0_5-IPC_A]
C190  10uF_25V_0603  [FP-CL10-IPC_C]
C191  0.1uF_16V_0402  [FP-C0402-BB-MFG]
C192  1uF_16V_0402  [FP-0402-L_1_0_0_05-W_0_5-IPC_A]
C193  0.1uF_16V_0402  [FP-C0402-BB-MFG]
C194  0.1uF_16V_0402  [FP-C0402-BB-MFG]
C195  1uF_16V_0402  [FP-0402-L_1_0_0_05-W_0_5-IPC_A]
C196  1uF_16V_0402  [FP-0402-L_1_0_0_05-W_0_5-IPC_A]
C197  1uF_16V_0402  [FP-0402-L_1_0_0_05-W_0_5-IPC_A]
C198  10pF_0402  [CAPC1005X55X25ML05T05]
C199  22pF_0402  [CAPC1005X55X25ML05T05]
C200  22pF_0402  [CAPC1005X55X25ML05T05]
C201  GRM0335C1H1R0BA01D  [FP-GRM033-0_03-IPC_C]
C202  GRM0335C1H1R0BA01D  [FP-GRM033-0_03-IPC_C]
C316  DNI_GRM0335C1H1R0BA01D  [FP-GRM033-0_03-IPC_C]  (no BOM)
C317  DNI_GRM0335C1H1R0BA01D  [FP-GRM033-0_03-IPC_C]  (no BOM)
C318  GRM0335C1H1R0BA01D  [FP-GRM033-0_03-IPC_C]
C327  GRM0335C1H1R0BA01D  [FP-GRM033-0_03-IPC_C]
C328  DNI_GRM0335C1H1R0BA01D  [FP-GRM033-0_03-IPC_C]  (no BOM)
C329  DNI_GRM0335C1H1R0BA01D  [FP-GRM033-0_03-IPC_C]  (no BOM)
L3  LQG15WZ2N0C02D  [FP-LQG15WH_02-IPC_B]
L48  LQP03TN1N2B02D  [FP-LQP03TG_02-IPC_A]
L49  LQP03TN1N2B02D  [FP-LQP03TG_02-IPC_A]
P9  U.FL-R-SMT(01)  [HRS-U.FL-R-SMT(10)_V]
P10  U.FL-R-SMT(01)  [HRS-U.FL-R-SMT(10)_V]
R90  0_0201  [FP-RC_L0201-MFG]
R109  0_0201  [FP-RC_L0201-MFG]
R122  10K_1%_0402  [RESC1005X40X25NL10T10]
R123  10K_1%_0402  [RESC1005X40X25NL10T10]
R124  0_5%_0402  [RESC1005X40X25NL05T10]
R125  DNI_10K_1%_0402  [RESC1005X40X25NL10T10]  (no BOM)
R126  DNI_0_5%_0402  [RESC1005X40X25NL05T10]  (no BOM)
R127  0_5%_0402  [RESC1005X40X25NL05T10]
R128  0_5%_0402  [RESC1005X40X25NL05T10]
R129  0_5%_0402  [RESC1005X40X25NL05T10]
R130  0_5%_0402  [RESC1005X40X25NL05T10]
R131  0_5%_0402  [RESC1005X40X25NL05T10]
R132  0_5%_0402  [RESC1005X40X25NL05T10]
R133  0_5%_0402  [RESC1005X40X25NL05T10]
R134  0_5%_0402  [RESC1005X40X25NL05T10]
R135  DNI_10K_1%_0402  [RESC1005X40X25NL10T10]  (no BOM)
R136  DNI_10K_1%_0402  [RESC1005X40X25NL10T10]  (no BOM)
R137  10K_1%_0402  [RESC1005X40X25NL10T10]
R138  10K_1%_0402  [RESC1005X40X25NL10T10]
R139  10K_1%_0402  [RESC1005X40X25NL10T10]
R140  DNI_10K_1%_0402  [RESC1005X40X25NL10T10]  (no BOM)
R141  10K_1%_0402  [RESC1005X40X25NL10T10]
R142  DNI_10K_1%_0402  [RESC1005X40X25NL10T10]  (no BOM)
R143  0_5%_0402  [RESC1005X40X25NL05T10]
SW3  B3U-1000P  [FP-B3U-1000P-MFG]
SW4  B3U-1000P  [FP-B3U-1000P-MFG]
U19  1655  [ADA-RGB-1655_V]
U24  ESP32-S3  [IC_ESP32-S3]
U25  W25Q128JVSIQ  [IC_W25Q128JVSIQ]
Y3  ABS05W-32.768KHZ-K-2-T  [FP-ABS05W-MFG]

### Blocks framed on the sheet
STRAPPING PINS: R135-R142

### Nets
GND: C185.2 C186.2 C187.2 C188.2 C189.2 C190.2 C191.2 C192.2 C193.2 C194.2 C195.2 C196.2 C197.2 C199.1 C200.1 C201.1 C202.1 C316.1 C317.1 C318.1 C327.1 C328.1 C329.1 P9.2 P9.3 P10.2 P10.3 R126.1 R139.1 R140.1 R141.1 R142.1 SW3.1 SW4.1 U19.3(VSS) U24.57(GND) U25.4(GND)
P3V3: C186.1 C187.1 C190.1 C191.1 C192.1 C193.1 C194.1 C195.1 L3.1 R122.2 R123.2 R135.2 R136.2 R137.2 R138.2 U19.1(VDD) U24.20(VDD3P3_RTC) U24.46(VDD3P3_CPU) U24.55(VDDA1) U24.56(VDDA2)
P3V3_VDD3P3_TX: C185.1 L3.2 U24.2(VDD3P3) U24.3(VDD3P3)
VDD_TX_SPI: C188.1 C189.1 U24.29(VDD_SPI) U25.8(VCC)
DPLL_CLKIN_7_P: U24.14(GPIO9) ; off-sheet DPLL_CLKIN_7_P
DPLL_CLKOUT1_P: R124.1 ; off-sheet DPLL_CLKOUT1_P
ESP_ANT: C317.2 R90.2 ; off-sheet ESP_ANT
ESP_ANT_CHIP: C201.2 L48.1 U24.1(LNA_IN) ; off-sheet ESP_ANT_CHIP
ESP_FPGA_SPARE1: U24.16(GPIO11) ; off-sheet ESP_FPGA_SPARE1
ESP_FPGA_SPARE2: U24.17(GPIO12) ; off-sheet ESP_FPGA_SPARE2
ESP_FPGA_SPARE3: U24.18(GPIO13) ; off-sheet ESP_FPGA_SPARE3
ESP_FPGA_SPARE4: U24.12(GPIO7) ; off-sheet ESP_FPGA_SPARE4
ESP_FPGA_SPARE5: U24.13(GPIO8) ; off-sheet ESP_FPGA_SPARE5
ESP_FPGA_SPARE6: U24.15(GPIO10) ; off-sheet ESP_FPGA_SPARE6
ESP_STM_SPARE1: U24.38(GPIO33) ; off-sheet ESP_STM_SPARE1
ESP_STM_SPARE2: U24.39(GPIO34) ; off-sheet ESP_STM_SPARE2
ESP_STM_SPARE3: U24.40(GPIO35) ; off-sheet ESP_STM_SPARE3
ESP_STM_SPARE4: U24.41(GPIO36) ; off-sheet ESP_STM_SPARE4
ESPTX_1PPS_OUT: U24.27(GPIO21)
ESPTX_32K_N: C200.2 R125.1 U24.22(XTAL_32K_N) Y3.2
ESPTX_32K_P: C199.2 R125.2 U24.21(XTAL_32K_P) Y3.1
ESPTX_GPIO0: C196.1 R122.1 R137.1 R142.2 SW3.2 U24.5(GPIO0) ; off-sheet ESPTX_GPIO0
ESPTX_GPIO3: R138.1 R140.2 U24.8(GPIO3) ; off-sheet ESPTX_GPIO3
ESPTX_GPIO14: U24.19(GPIO14) ; off-sheet ESPTX_GPIO14
ESPTX_GPIO17: U24.23(GPIO17) ; off-sheet ESPTX_GPIO17
ESPTX_GPIO38: U19.4(DIN) U24.43(GPIO38) ; off-sheet ESPTX_GPIO38
ESPTX_GPIO45: R136.1 R141.2 U24.51(GPIO45)
ESPTX_GPIO46: R135.1 R139.2 U24.52(GPIO46)
ESPTX_MTCK: U24.44(MTCK)
ESPTX_MTDI: U24.47(MTDI)
ESPTX_MTDO: U24.45(MTDO)
ESPTX_MTMS: U24.48(MTMS)
ESPTX_R_USB_D_N: R128.1 U24.25(GPIO19)
ESPTX_R_USB_D_P: R129.1 U24.26(GPIO20)
ESPTX_RF_SW6: U24.7(GPIO2)
ESPTX_RF_SW7: U24.6(GPIO1)
ESPTX_RST: C197.1 R123.1 SW4.2 U24.4(CHIP_PU) ; off-sheet ESP_RST  [also labelled ESP_RST]
ESPTX_SPI_MGMT_MISO: U24.37(SPICLK_P)
ESPTX_SPICLK: R132.1 U25.6(CLK)
ESPTX_SPICLK_R: R132.2 U24.33(SPICLK)
ESPTX_SPICS0: U24.32(SPICS0) U25.1(~{CS})
ESPTX_SPID: R134.1 U25.5(DI)
ESPTX_SPID_R: R134.2 U24.35(SPID)
ESPTX_SPIHD: R130.1 U25.7(~{HOLD})
ESPTX_SPIHD_R: R130.2 U24.30(SPIHD)
ESPTX_SPIQ: R133.1 U25.2(DO)
ESPTX_SPIQ_R: R133.2 U24.34(SPIQ)
ESPTX_SPIWP: R131.1 U25.3(~{WP})
ESPTX_SPIWP_R: R131.2 U24.31(SPIWP)
ESPTX_UART0_RX: R143.2 U24.49(U0TXD)
ESPTX_UART0_TX: R127.2 U24.50(U0RXD)
ESPTX_USB_D_N: R128.2 ; off-sheet ESPTX_USB_D_N
ESPTX_USB_D_P: R129.2 ; off-sheet ESPTX_USB_D_P
MGMT_1PPS_OUT_BUFF1: U24.36(SPICLK_N)
SPI5_MISO: U24.10(GPIO5) ; off-sheet SPI5_MISO
SPI5_MOSI: U24.11(GPIO6) ; off-sheet SPI5_MOSI
SPI5_SCK: U24.9(GPIO4) ; off-sheet SPI5_SCK
UART4_RX: R143.1 ; off-sheet UART4_RX
UART4_TX: R127.1 ; off-sheet UART4_TX
NetC198_1: C198.1 R124.2 R126.2
NetC198_2: C198.2 U24.54(XTAL_P)
NetC202_2: C202.2 C316.2 L48.2 R90.1
NetC318_2: C318.2 L49.1 P9.1
NetC327_2: C327.2 C328.2 L49.2 R109.1
NetC329_2: C329.2 P10.1 R109.2

Not connected (* = marked no-connect by the designer): U19 2(DOUT); U24 24(GPIO18) 28(SPICS1)* 42(GPIO37) 53(XTAL_N)*

### Layout directives
differential pair: ESPTX_R_USB_D_N, ESPTX_R_USB_D_P, ESPTX_USB_D_N, ESPTX_USB_D_P
net class Power: VDD_TX_SPI
net class RF: ESP_ANT, ESP_ANT_CHIP, NetC202_2, NetC318_2, NetC327_2, NetC329_2

### Notes on the sheet
- (near U25) SPI FLASH
- (place near pin 46)
- (place near pin 20)
- (place near pin 56 and 55)
- (place near pin 29)
- (near U24) ESP32-S3
- 32KHZ XTAL
- (1pps input from mgmt)
- (near L49) Calibration ports

### Library data of the parts
C185 C188 C191 C193 C194 = CMP-1034-02068-3: as C35 on sheet 11-Power; ComponentLink2URL: https://content.kemet.com/datasheets/KEM_C1002_X7R_SMD.pdf; Automotive: No; Device Class L2: Capacitors; Temperature: -55°C to +125°C; RoHS: TRUE; Voltage Rating: 16 V; ComponentLink2Description: Datasheet; Device Class L3: Ceramic Capacitors; Temperature Range Low: -55°C; Ipc Land Pattern Name: CAPC10050X50; Device Class L1: Passive Components; Temperature Range High: +125°C; Package: C0402-BB; Capacitance: 0.10 μF; Category: Cap; Mouser Description: CAP CER 0.1UF 16V X7R 0402; Height: 0.55mm; Digikey Description: CAP CER 0.1UF 16V 5% X7R 0402; Octopart: https://octopart.com/c0402c104j4ractu-kemet-12573893; Temperature Characteristic: X7R; Lead Free: Yes
C186 C189 C192 C195-C197 = CMP-14477-000104-2: as C129 on sheet 11-Power; Packaging: Tape and Reel; Depth: 0.5mm; Mount: Surface Mount; Thickness: 0.022inch; Package Quantity: 1; Min Operating Temperature: -55°C; Series: M; Voltage Rating (DC): 16V; Termination: SMD/SMT; Case/Package: 0402; Number of Pins: 2; Case Code (Imperial): 0402; Length: 1mm; Halogen Free: Halogen Free; Case Code (Metric): 1005; Width: 0.02inch; RoHS Compliant: Yes; Radiation Hardening: No; Max Operating Temperature: 85°C; Height: 0.5mm; Construction: Flat
C187 = CMP-2008-03723-3: Ceramic Capacitor for Automotive 10nF ±10% 50VDC X7R 0402 Paper T/R; Voltage Rating (DC): 50V; Min Operating Temperature: -55°C; Radiation Hardening: No; Mount: Surface Mount; Thickness: 0.022inch; Package Quantity: 1; Case Code (Imperial): 0402; Lead Free: Lead Free; Case/Package: 0402; Depth: 0.5mm; Termination: SMD/SMT; Tolerance: 10%; Voltage: 50V; Packaging: Tape and Reel; Width: 0.02inch; REACH SVHC: No SVHC; Height: 0.5mm; Max Operating Temperature: 125°C; Case Code (Metric): 1005; Voltage Rating: 50V; Capacitance: 10nF; Ratings: AEC-Q200; Length: 1mm; Dielectric: X7R
C190 = CMP-13271-004224-1: Cap Ceramic 10uF 25V X5R ±20% Pad SMD 0603 +85°C T/R; Width: 0.031inch; Voltage Rating: 25V; Length: 0.063inch; Case Code (Metric): 1608; Dielectric: X5R; Termination: Wraparound; Capacitance: 10uF; Lead Free: Lead Free; Mount: Surface Mount; Package Quantity: 1; Case Code (Imperial): 0603; Thickness: 0.035inch; Packaging: Tape and Reel; Contact Plating: Tin; Min Operating Temperature: -55°C; Tolerance: 20%; Max Operating Temperature: 85°C; Case/Package: 0603
C198 = CMP-2100-03589-1: Chip Capacitor, 10 pF, +/- 5%, 50 V, -55 to 125 degC, 0402 (1005 Metric), RoHS, Tape and Reel; Manufacturer: Yageo; Insulation Resistance: 100GR; Voltage Rating (DC): 50V; Dielectric Material: Ceramic; Temperature Coefficient: 30ppm/degC; Dielectric: C0G; Capacitance: 10pF; Termination: SMD/SMT; Package Reference: 0402; Lead Free: LeadFree; Composition: Ceramic; Tolerance: 5%; Case Code (Metric): 1005; Voltage Rating: 50V; Packaging: TapeandReel; Manufacturer URL: http://www.yageo.com/; REACH SVHC: NoSVHC; Max Operating Temperature: 125degC; Length: 1mm; Mount: SurfaceMount; Depth: 0.5mm; Min Operating Temperature: -55degC; Number of Pins: 2; Width: 0.02inch; Datasheet Version: Rev. 14, 07/2016; Package Quantity: 1; Datasheet URL: http://www.yageo.com/documents/recent/UPY-GP_NP0_16V-to-50V_14.pdf; Case Code (Imperial): 0402; RoHSCompliant: True; Radiation Hardening: No; Height: 0.5mm; Case/Package: 0402; Thickness: 0.022inch; Package Description: 2-Pin Surface Mount Device, Body 1 x 0.5 mm; Voltage: 50V
C199 C200 = CMP-2100-03590-1: Chip Capacitor, 22 pF, +/- 5%, 50 V, -55 to 125 degC, 0402 (1005 Metric), RoHS, Tape and Reel; Manufacturer: Yageo; Voltage Rating: 50V; Dielectric Material: Ceramic; Capacitance: 22pF; Temperature Coefficient: 30ppm/degC; Dielectric: C0G; Insulation Resistance: 100GR; Datasheet URL: http://www.yageo.com/NewPortal/yageodocoutput?fileName=/pdf/MLCC/UPY-GP_NP0_16V-to-50V_14.pdf; Depth: 0.5mm; Number of Pins: 2; Height: 0.5mm; Min Operating Temperature: -55degC; REACH SVHC: NoSVHC; Max Operating Temperature: 125degC; Voltage Rating (DC): 50V; Composition: Ceramic; Packaging: TapeandReel; Package Quantity: 1; Package Reference: 0402; Length: 1mm; Radiation Hardening: No; Package Description: 2-Pin Surface Mount Device, Body 1 x 0.5 mm; RoHSCompliant: True; Thickness: 0.022inch; Manufacturer URL: http://www.yageo.com/; Mount: SurfaceMount; Case Code (Metric): 1005; Case/Package: 0402; Tolerance: 5%; Termination: SMD/SMT; Width: 0.02inch; Datasheet Version: Rev. 14, 07/2016; Lead Free: LeadFree; Case Code (Imperial): 0402
C201 C202 C316-C318 C327-C329 = CMP-2010-01509-2: Chip Multilayer Ceramic Capacitors for General Purpose, 0201, 1.0pF, C0G, 30ppm/°C, 0.1pF, 50V; Capacitance: 1pF; Termination: SMD/SMT; Depth: 0.3mm; Mount: Surface Mount; Case Code (Metric): 0603; Length: 0.024inch; Voltage Rating: 50V; Voltage Rating (DC): 50V; Width: 0.012inch; Lead Free: Lead Free; Dielectric: C0G; Thickness: 0.013inch; Packaging: Tape and Reel; Case Code (Imperial): 0201; Case/Package: 0201; Package Quantity: 15000; Min Operating Temperature: -55°C; Max Operating Temperature: 125°C
L3 = CMP-06042-012509-1: Multilayer type Inductor for Automotive 2nH ±0.2nH 0.05Ω 1000mA 0402; Test Frequency: 100MHz; Shielding: Unshielded; DC Resistance (DCR): 50mR; Self Resonant Frequency: 8GHz; Current Rating: 1A; Core Material: Air; Case Code (Metric): 1005; Case/Package: 0402; Mount: Surface Mount; Min Operating Temperature: -55°C; Inductance: 2nH; Ratings: AEC-Q200; Max Operating Temperature: 125°C; Packaging: Cut Tape; Case Code (Imperial): 0402
L48 L49 = CMP-06042-001577-1: Film type RF Inductor 1.2nH ±0.1nH 750mA 0.1Ω 0201 (0603); DC Resistance (DCR): 100mR; Current: 600mA; Core Material: Non-Magnetic; Shielding: Unshielded; Q Factor: 14; Test Frequency: 500MHz; Self Resonant Frequency: 6GHz; Inductance: 1.2nH; Mount: Surface Mount; Package Quantity: 15000; Length: 0.024inch; Resistor Type: Thin Film; Min Operating Temperature: -55°C; Depth: 0.33mm; Height: 0.012inch; Max DC Current: 750mA; Width: 0.012inch; Case/Package: 0201; Case Code (Imperial): 0201; Lead Free: Lead Free; Military Standard: Not; Termination: SMD/SMT; Max Operating Temperature: 125°C; DC Current: 750mA; Packaging: Tape and Reel; Case Code (Metric): 0603; Height - Seated (Max): 0.013inch; REACH SVHC: No SVHC; Radiation Hardening: No; Current Rating: 750mA
P9 P10 = CMP-2000-05151-1: CONN RECPT ULTRA-MINI COAX SMD; Manufacturer: Hirose Electric; Centre Contact Resistance: 25mohm; Voltage Rating V AC: 60V; Female Contact Material: PhosphorBronze; Contact Resistance: 10mohm; Male Contact Material: Brass; Connector Type: UFLCoaxial; Connector Mounting: PCB; Impedance: 50ohm; Insulation Resistance: 500Mohm; Secondary Insulation Material: PBT; Frequency Max: 6GHz; Body Plating: Silver; External Length / Height: 2.5mm; Approval Category: UL94V-0; Female Contact Plating: Gold; Connector Mounting Orientation: PCBoard; VSWR: 1.3; Coaxial Termination: Solder; Body Style: StraightJack; SVHC: NoSVHC(18-Jun-2012); Jacket Material: LCP; Package Reference: U.FL-R-SMT(10); Datasheet Version: Feb-04; Outer Contact Resistance: 10mohm; Contact Plating: Gold; Mounting Type: PCBoard; Flammability Rating: UL94V-0; Operating Frequency Max: 6GHz; Termination Method: Solder; Male Contact Plating: Gold; Package Description: 3-Pin Surface Mount Device, Body 2.6 x 2.6 mm; Operating Temperature Min: -40degC; Manufacturer URL: https://www.hirose.com; Operating Temperature Max: 90degC; Contact Material: PhosphorBronze; Datasheet URL: http://www.farnell.com/datasheets/91524.pdf; Material: PhosphorBronze
R90 R109 = CMP-03412-023265-1: RES SMD 0 OHM JUMPER 1/20W 0201; Manufacturer: Yageo; Manufacturer Part Number: RC0201JR-070RL; Power Rating: 50mW; Value: 0Ω; Temperature Coefficient: 200ppm/°C; Voltage Rating: 25V; Tolerance: 5%; Octopart: https://octopart.com/rc0201jr-070rl-yageo-43171986; ComponentLink2URL: http://www.yageo.com/documents/recent/PYu-RC_Group_51_RoHS_L_10.pdf; Device Class L2: Resistors; Series: RC_L; Ipc Land Pattern Name: RESC6030X23; Temperature: -55°C to +125°C; Mouser Description: Thick Film Resistors ZERO OHM JUMPER; Footprint Url: http://www.yageo.com/exep/pages/download/literatures/PYu-R_Mount_10.pdf; RoHS: TRUE; Package: RC_L0201; Device Class L3: Chip SMD Resistors; Temperature Range Low: -55°C; Composition: Thick Film; ComponentLink2Description: Datasheet; Height: 0.26mm; Device Class L1: Passive Components; Category: Res; Resistance: 0Ω; Temperature Range High: +125°C; Automotive: No; Lead Free: Yes; Digikey Description: RES SMD 0 OHM JUMPER 1/20W 0201
R122 R123 R125 R135-R142 = CMP-2002-04694-1: as R53 on sheet 11-Power
R124 R126-R134 R143 = CMP-2002-06457-1: as R79 on sheet 11-Power
SW3 SW4 = CMP-2100-03586-2: SWITCH TACTILE SPST-NO 0.05A 12V; Contact Resistance: 100mR; Operating Force: 1.5N; Max Current Rating: 50mA; Switch Travel: 0.15mm; Actuator Type: Standard; Mechanical Life: 200000Cycles; Ratings: Dust Proof; Illumination Type: Non-Illuminated; Throw Configuration: SPST; Actuator Length: 0.4mm; Switch Function: Off-Mom; Height: 1.2mm; Width: 3mm; Weight: 0.000776oz; Contact Material: Silver; Max Voltage Rating (DC): 12V; Insulation Resistance: 100MR; Lead Free: Lead Free; Current Rating: 50mA; Termination: SMD/SMT; Length: 4mm; Voltage Rating (DC): 12V; Contact Current Rating: 50mA; Orientation: Straight; Depth: 2.5mm; Max Operating Temperature: 70°C; Packaging: Tape and Reel; Min Operating Temperature: -25°C; Package Quantity: 1; Mount: Surface Mount; Electrical Life: 200000Cycles
U19 = CMP-2000-05026-1: Intelligent Control LED Integrated Light Source, 3.5 to 5.3 V, -25 to 80 degC, 4-Pin SMD, RoHS, Tape and Reel; Manufacturer: Adafruit-Industries-LLC; Number of LEDs: 10; Configuration: Discrete; Utilized LED: WS2812(5050); Datasheet URL: http://datasheet.octopart.com/ADA1655-Adafruit-Industries-datasheet-32028139.pdf; Series: Neopixel; Interface: -; Package Description: 4-Pin Surface Mount Device, Body 5 x 5 mm; Color: Red,Green,Blue(RGB); Category: Optoelectronics; Controller Type: -; Package Reference: 1655; Manufacturer URL: https://www.adafruit.com/; Mounting Type: SurfaceMount; Datasheet Version: May-13; Size / Dimension: 5.00mmLx5.00mmW; Family: Addressable,Specialty
U24 = IC_ESP32-S3: IC RF TxRx + MCU Bluetooth, WiFi 802.11b/g/n, Bluetooth v5.0 2.412GHz ~ 2.484GHz 56-VFQFN Exposed Pad; MF: Espressif Systems; Check_prices: https://www.snapeda.com/parts/ESP32-S3/Espressif+Systems/view-part/?ref=eda; Purchase-URL: https://pricing.snapeda.com/search/part/ESP32-S3/?ref=eda; Value: *; Availability: In Stock; Package: None; SnapEDA_Link: https://www.snapeda.com/parts/ESP32-S3/Espressif+Systems/view-part/?ref=snap; MP: ESP32-S3; Price: None; Supplier 1: LCSC; Supplier Part Number 1: C2913192
U25 = IC_W25Q128JVSIQ: NOR Flash Serial (SPI, Dual SPI, Quad SPI) 3.3V 128M-bit 16M x 8 6ns 8-Pin SOIC Tube; Manufacturer: Winbond; Memory Format: Non-Volatile,FLASH; Frequency: 133MHz; Memory Size: 128Mb; Supplier 1: Digi-Key; Manufacturer Part Number: W25Q128JVSIQ; RoHS: Yes; Category: Flash; Stock 1: 154352; Pricing 1: 1=1.71, 10=1.562, 25=1.52, 50=1.5124, 100=1.3519, 250=1.348, 500=1.32762, 1000=1.27127, 5000=1.18359 (USD); Mounting Technology: Surface Mount; Case/Package: SOIC; Min Operating Temperature: -40°C; Max Operating Temperature: 85°C; Packaging: Tray; Series: SpiFlash®; RoHS Compliant: Yes; ComponentLink1URL: http://www.winbond.com/resource-files/w25q128jv%20revf%2003272018%20plus.pdf?src-supplier=Digi-Key; ComponentLink1Description: http://www.winbond.com/resource-files/w25q128jv%20revf%2003272018%20plus.pdf?src-supplier=Digi-Key; Supplier Part Number 1: W25Q128JVSIQ-ND
Y3 = CMP-27762-015607-1: Crystal 32.768kHz ±20ppm (Tol) 4pF 85kΩ 2-Pin SMD T/R; ESR (Equivalent Series Resistance): 85kR; Frequency Tolerance: 20ppm; Mount: Surface Mount; Load Capacitance: 4pF; Case/Package: SMD/SMT; Packaging: Cut Tape; Frequency: 32.768kHz; Series: ABS05W; Min Operating Temperature: -40°C; Max Operating Temperature: 125°C